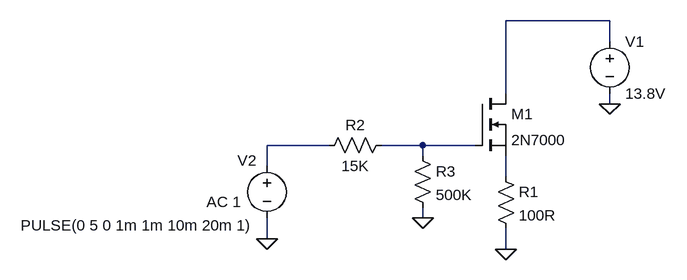
[diagram p0: schematic Current Switch Test.asc]
Current Switch Test.asc, the LTspice schematic file:
Version 4
SHEET 1 880 680
WIRE 416 -16 256 -16
WIRE 416 16 416 -16
WIRE 256 96 256 -16
WIRE 416 112 416 96
WIRE -16 176 -112 176
WIRE 128 176 64 176
WIRE 208 176 128 176
WIRE 128 192 128 176
WIRE -112 208 -112 176
WIRE 256 224 256 192
WIRE 128 288 128 272
WIRE -112 320 -112 288
WIRE 256 336 256 304
FLAG 256 336 0
FLAG -112 320 0
FLAG 128 288 0
FLAG 416 112 0
SYMBOL nmos 208 96 R0
SYMATTR InstName M1
SYMATTR Value 2N7000
SYMBOL voltage 416 0 R0
WINDOW 123 0 0 Left 2
WINDOW 39 0 0 Left 2
SYMATTR InstName V1
SYMATTR Value 13.8V
SYMBOL res 240 208 R0
SYMATTR InstName R1
SYMATTR Value 100R
SYMBOL res 80 160 R90
WINDOW 0 0 56 VBottom 2
WINDOW 3 32 56 VTop 2
SYMATTR InstName R2
SYMATTR Value 15K
SYMBOL voltage -112 192 R0
WINDOW 0 -45 7 Left 2
WINDOW 3 -379 107 Left 2
WINDOW 123 -93 71 Left 2
WINDOW 39 0 0 Left 2
SYMATTR InstName V2
SYMATTR Value PULSE(0 5 0 1m 1m 10m 20m 1)
SYMATTR Value2 AC 1
SYMBOL res 112 176 R0
SYMATTR InstName R3
SYMATTR Value 500K

The netlist it stands for:
* Current Switch Test.asc
M1 N001 N003 N004 N004 2N7000
V1 N001 0 13.8V
R1 N004 0 100R
R2 N003 N002 15K
V2 N002 0 PULSE(0 5 0 1m 1m 10m 20m 1) AC 1
R3 N003 0 500K
.model NMOS NMOS
.model PMOS PMOS
.lib standard.mos
.backanno
.end